# Altium schematic sheet 第二路电压隔离原理图.SchDoc
size A4
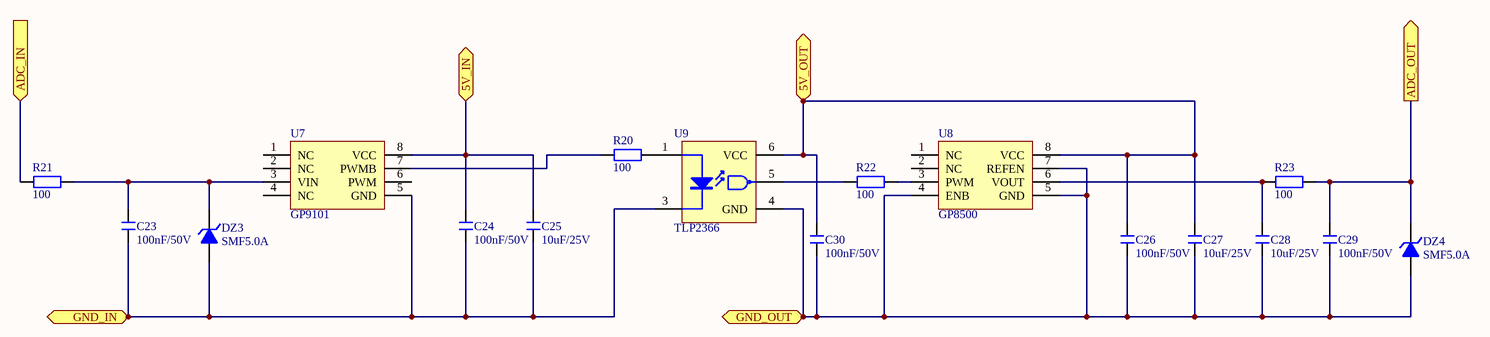
[diagram p0: 第二路电压隔离原理图.SchDoc]

## Parts
C23  100nF/50V  [C 0603_M]
C24  100nF/50V  [C 0603_M]
C25  10uF/25V  [C 0603_M]
C26  100nF/50V  [C 0603_M]
C27  10uF/25V  [C 0603_M]
C28  10uF/25V  [C 0603_M]
C29  100nF/50V  [C 0603_M]
C30  100nF/50V  [C 0603_M]
DZ3  SMF5.0A  [SOD-123]
DZ4  SMF5.0A  [SOD-123]
R20  100  [R 0603_M]
R21  100  [R 0603_M]
R22  100  [R 0603_M]
R23  100  [R 0603_M]
U7  GP9101  [SOP8_N]
U8  GP8500  [SOP8_N]
U9  TLP2366  [SOP5_N]

## Ports
5V_IN (bidir), 5V_OUT (bidir), ADC_IN (in), ADC_OUT (out), GND_IN (bidir), GND_OUT (bidir)

## Nets
5V_IN: C24.2 C25.2 U7.8(VCC) ; port 5V_IN
5V_OUT: C26.2 C27.2 C30.2 U8.8(VCC) U9.6(VCC) ; port 5V_OUT
ADC_IN: R21.1 ; port ADC_IN
ADC_OUT: C29.2 DZ4.2(K) R23.2 ; port ADC_OUT
GND_IN: C23.1 C24.1 C25.1 DZ3.1(A) U7.5(GND) U9.3(LED-) ; port GND_IN
GND_OUT: C26.1 C27.1 C28.1 C29.1 C30.1 DZ4.1(A) U8.4(ENB) U8.5(GND) U8.7(REFEN) U9.4(GND) ; port GND_OUT
NetC23_2: C23.2 DZ3.2(K) R21.2 U7.3(VIN)
NetC28_2: C28.2 R23.1 U8.6(VOUT)
NetR20_1: R20.1 U7.7(PWMB)
NetR20_2: R20.2 U9.1(LED+)
NetR22_1: R22.1 U9.5(GND)
NetR22_2: R22.2 U8.3(PWM)

Not connected (* = marked no-connect by the designer): U7 1(NC) 2(NC) 4(NC) 6(PWM); U8 1(NC) 2(NC)

## Library data of the parts
C23-C30 = C: 无极性贴片电容; 版权归属: 源创客; 材质: X7R; BOM名称: 无极性贴片电容; 学习资源: www.ooocke.com
DZ3 DZ4 = 1N4620: 3.3V/0.5W稳压管; 版权归属: 源创客; BOM名称: 3.3V/0.5W稳压管; 学习资源: www.ooocke.com
R20-R23 = R: 贴片电阻; 版权归属: 源创客; BOM名称: 贴片电阻; 学习资源: www.ooocke.com
U7 = GP9101: 将0V到VCC的模拟电压输入，线性转换成0%-100%占  空比的PWM信号输出
U8 = GP8500: 0%-100% PWM 转 0-2.5V/0-VCC
U9 = TLP2366: 单路高速光耦